# Altium schematic sheet [11]VIDEO_PORT.SchDoc
size B
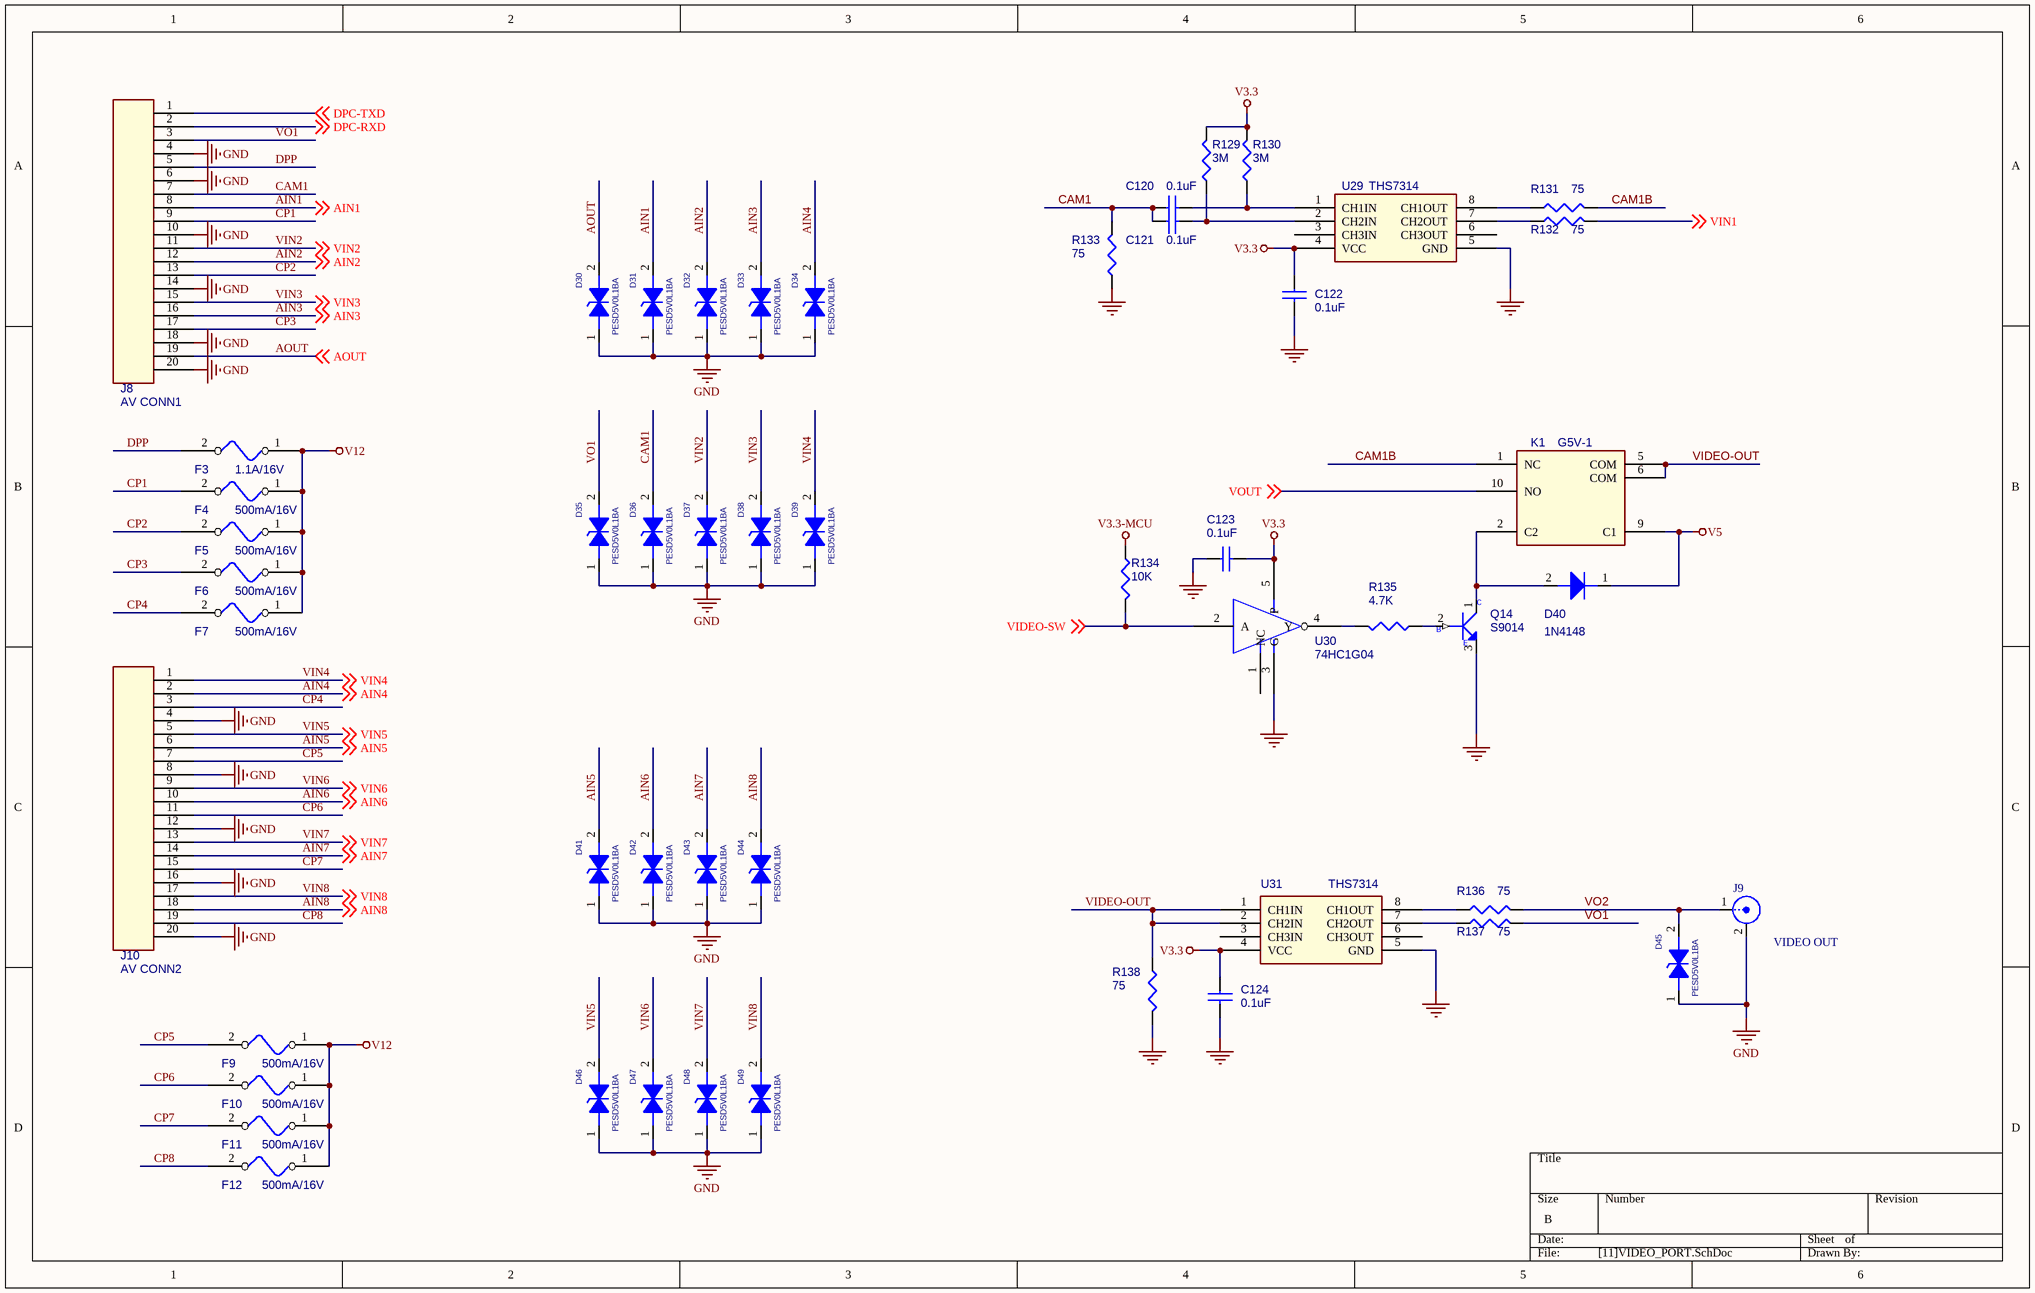
[diagram p0: [11]VIDEO_PORT.SchDoc]

## Parts
C120  0.1uF  [0603]
C121  0.1uF  [0603]
C122  0.1uF  [0603]
C123  0.1uF  [0603]
C124  0.1uF  [0603]
D30  PESD5V0L1BA  [SOD323]
D31  PESD5V0L1BA  [SOD323]
D32  PESD5V0L1BA  [SOD323]
D33  PESD5V0L1BA  [SOD323]
D34  PESD5V0L1BA  [SOD323]
D35  PESD5V0L1BA  [SOD323]
D36  PESD5V0L1BA  [SOD323]
D37  PESD5V0L1BA  [SOD323]
D38  PESD5V0L1BA  [SOD323]
D39  PESD5V0L1BA  [SOD323]
D40  1N4148  [MINI-MELF]
D41  PESD5V0L1BA  [SOD323]
D42  PESD5V0L1BA  [SOD323]
D43  PESD5V0L1BA  [SOD323]
D44  PESD5V0L1BA  [SOD323]
D45  PESD5V0L1BA  [SOD323]
D46  PESD5V0L1BA  [SOD323]
D47  PESD5V0L1BA  [SOD323]
D48  PESD5V0L1BA  [SOD323]
D49  PESD5V0L1BA  [SOD323]
F3  1.1A/16V  [1812]
F4  500mA/16V  [1812]
F5  500mA/16V  [1812]
F6  500mA/16V  [1812]
F7  500mA/16V  [1812]
F9  500mA/16V  [1812]
F10  500mA/16V  [1812]
F11  500mA/16V  [1812]
F12  500mA/16V  [1812]
J8  AV CONN1  [CONN2X10]
J9  VIDEO OUT  [RCA2]
J10  AV CONN2  [CONN2X10]
K1  G5V-1  [G5V-1]
Q14  S9014  [NPN]
R129  3M  [0603]
R130  3M  [0603]
R131  75  [0603]
R132  75  [0603]
R133  75  [0603]
R134  10K  [0603]
R135  4.7K  [0603]
R136  75  [0603]
R137  75  [0603]
R138  75  [0603]
U29  THS7314  [so8]
U30  74HC1G04  [SOT753]
U31  THS7314  [so8]

## Nets
GND: C122.2 C123.1 C124.2 D30.1 D31.1 D32.1 D33.1 D34.1 D35.1 D36.1 D37.1 D38.1 D39.1 D41.1 D42.1 D43.1 D44.1 D45.1 D46.1 D47.1 D48.1 D49.1 J8.4 J8.6 J8.10 J8.14 J8.18 J8.20 J9.2(Y) J10.4 J10.8 J10.12 J10.16 J10.20 Q14.3(EMITTER) R133.1 R138.2 U29.5(GND) U30.3(G) U31.5(GND)
V3.3: C122.1 C123.2 C124.1 R129.2 R130.2 U29.4(VCC) U30.5(P) U31.4(VCC)
V3.3-MCU: R134.1
V5: D40.1 K1.9(C1)
V12: F3.1 F4.1 F5.1 F6.1 F7.1 F9.1 F10.1 F11.1 F12.1
AIN1: D31.2 J8.8 ; off-sheet AIN1
AIN2: D32.2 J8.12 ; off-sheet AIN2
AIN3: D33.2 J8.16 ; off-sheet AIN3
AIN4: D34.2 J10.2 ; off-sheet AIN4
AIN5: D41.2 J10.6 ; off-sheet AIN5
AIN6: D42.2 J10.10 ; off-sheet AIN6
AIN7: D43.2 J10.14 ; off-sheet AIN7
AIN8: D44.2 J10.18 ; off-sheet AIN8
AOUT: D30.2 J8.19 ; off-sheet AOUT
CAM1: C120.1 C121.1 D36.2 J8.7 R133.2
CAM1B: K1.1(NC) R131.2
CP1: F4.2 J8.9
CP2: F5.2 J8.13
CP3: F6.2 J8.17
CP4: F7.2 J10.3
CP5: F9.2 J10.7
CP6: F10.2 J10.11
CP7: F11.2 J10.15
CP8: F12.2 J10.19
DPC-RXD: J8.2 ; off-sheet DPC-RXD
DPC-TXD: J8.1 ; off-sheet DPC-TXD
DPP: F3.2 J8.5
VIDEO-OUT: K1.5(COM) K1.6(COM) R138.1 U31.1(CH1IN) U31.2(CH2IN)
VIDEO-SW: R134.2 U30.2(A) ; off-sheet VIDEO-SW
VIN1: R132.2 ; off-sheet VIN1
VIN2: D37.2 J8.11 ; off-sheet VIN2
VIN3: D38.2 J8.15 ; off-sheet VIN3
VIN4: D39.2 J10.1 ; off-sheet VIN4
VIN5: D46.2 J10.5 ; off-sheet VIN5
VIN6: D47.2 J10.9 ; off-sheet VIN6
VIN7: D48.2 J10.13 ; off-sheet VIN7
VIN8: D49.2 J10.17 ; off-sheet VIN8
VO1: D35.2 J8.3 R137.2
VO2: D45.2 J9.1(X) R136.2
VOUT: K1.10(NO) ; off-sheet VOUT
NetC120_2: C120.2 R130.1 U29.1(CH1IN)
NetC121_2: C121.2 R129.1 U29.2(CH2IN)
NetD40_2: D40.2 K1.2(C2) Q14.1(COLLECTOR)
NetQ14_2: Q14.2(BASE) R135.1
NetR131_1: R131.1 U29.8(CH1OUT)
NetR132_1: R132.1 U29.7(CH2OUT)
NetR135_2: R135.2 U30.4(Y)
NetR136_1: R136.1 U31.8(CH1OUT)
NetR137_1: R137.1 U31.7(CH2OUT)

Not connected (* = marked no-connect by the designer): U29 3(CH3IN) 6(CH3OUT); U30 1(NC); U31 3(CH3IN) 6(CH3OUT)

## Notes on the sheet
- (in symbol MMBT3904_NL_SOT23-3) C; B; E

## Library data of the parts
C120-C122 C124 = CAP
C123 = P_CAP NP: Part Number: SE132225K8L; Part Description: S CER CAP 2.2U 10V K X5R 0603; Function Field: 41.5; Ecology: YES; ROOM: GPS; AP: AP; Part Type: CAPACITOR; Approved Date: 6/27/2006; Lead Free: MY
D30-D39 D41-D49 = PESD
D40 = 1N4148WS-7-F_SOD323-2
F3-F7 F9-F12 = 2A_32VDC_0467-002
J8 J10 = CON20
J9 = BNC: BNC Elbow Connector; LatestRevisionDate: 17-Jul-2002; LatestRevisionNote: Re-released for DXP Platform.; Publisher: Altium Limited
K1 = G5V-1_0
Q14 = MMBT3904_NL_SOT23-3: Part Description: S TR MMBT3904_NL NPN SOT23; Part Number: SB039040000
R129-R133 R136-R138 = R: Manufacturer Part number: null; Part Description: S RES 1/16W 10K +-5% 0402; Part Number: SD02810028L; ROOM: SD; Deletion Flag: 0; Function Field: 32.3; Ecology: YES; Part Type: RESISTOR; AP Sheet: http://ISPDPRD/Windchill/servlet/WindchillAuthGW/wt.enterprise.URLProcessor/URLTemplateAction?u8&oid=VR%3Aext.compal.part.Comp; AP: AP; Lead Free: Y1
R134 R135 = R: Part Number: SD02810028L; Part Description: S RES 1/16W 10K +-5% 0402; Manufacturer Part number: null; Ecology: YES; Function Field: 32.3; Deletion Flag: 0; ROOM: SD; Lead Free: Y1; AP: AP; AP Sheet: http://ISPDPRD/Windchill/servlet/WindchillAuthGW/wt.enterprise.URLProcessor/URLTemplateAction?u8&oid=VR%3Aext.compal.part.Comp; Part Type: RESISTOR
U30 = 74LVC1G04GW_SOT353-5: Part  Number: SA00000FX00